# EAGLE schematic Juice Rescue v2 - hw1.0.2 (EAGLE 9.6.2)
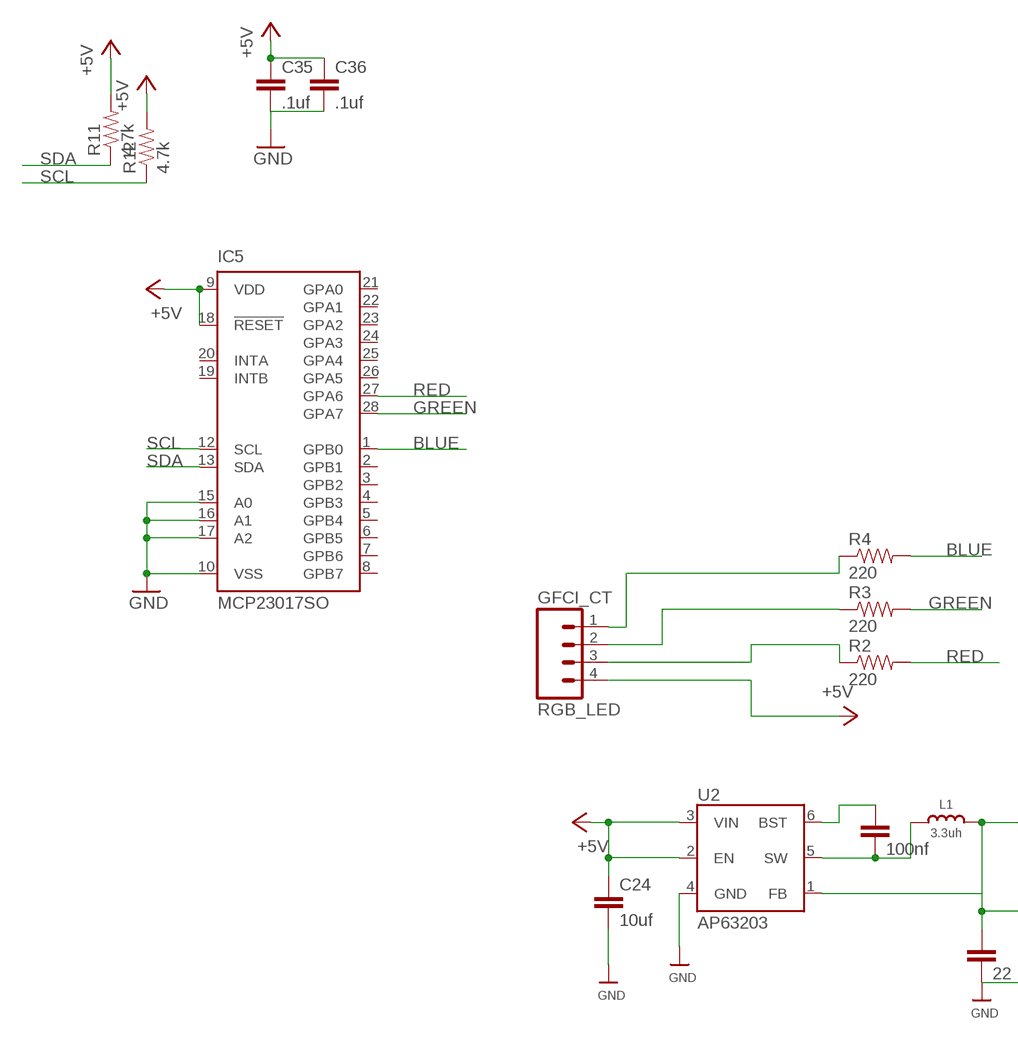
[diagram p0: schematic, sheet 1, part 1 of 2]
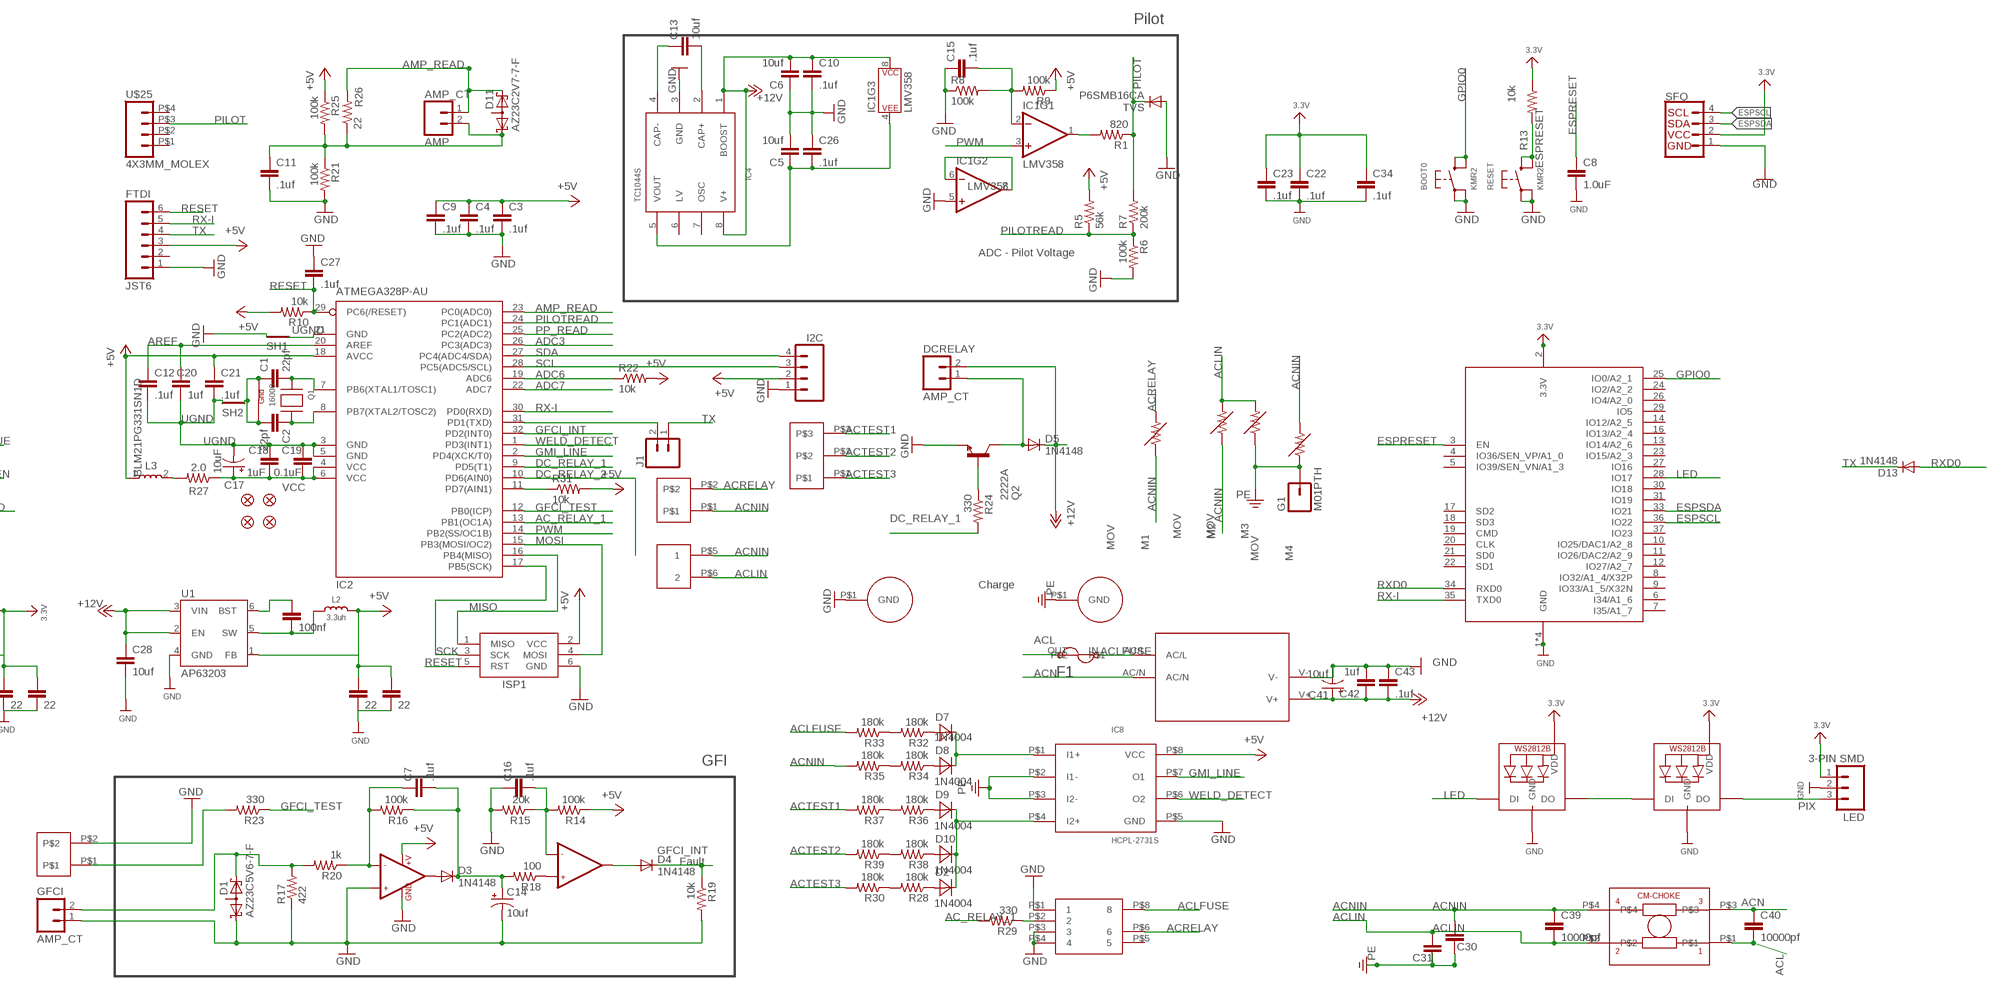
[diagram p1: schematic, sheet 1, part 2 of 2]

## Parts
AC  2POS3.96MM  [2POS3.66MM]
AC_TEST  AMPAC3P  [ACAMP3P]
AMP  AMP_CT  MOLEX_2  [MOLEX_2]
BOOT0  KMR2  SWITCH_TACT_SMT4.6X2.8  [BTN_KMR2_4.6X2.8]
C1  22pf  CAP0805  [0805]
C2  22pf  CAP0805  [0805]
C3  .1uf  CAP0805  [0805]
C4  .1uf  CAP0805  [0805]
C5  10uf  CAP0805  [0805]
C6  10uf  CAP0805  [0805]
C7  .1uf  CAP0805  [0805]
C8  1.0uF  1.0UF-0805-25V-(+80/-20%)  [0805]
C9  .1uf  CAP0805  [0805]
C10  .1uf  CAP0805  [0805]
C11  .1uf  CAP0805  [0805]
C12  .1uf  CAP0805  [0805]
C13  10uf  CAP0805  [0805]
C14  10uf  CAP_POL1206  [EIA3216]
C15  .1uf  CAP0805  [0805]
C16  .1uf  CAP0805  [0805]
C17  10uF  10UF-POLAR-0603-6.3V-20%(TANT)  [0603-POLAR]
C18  1uF  CAP0805  [0805]
C19  0.1uF  CAP0805  [0805]
C20  1uf  CAP0805  [0805]
C21  .1uf  CAP0805  [0805]
C22  .1uf  1.0UF-0805-25V-(+80/-20%)  [0805]
C23  .1uf  1.0UF-0805-25V-(+80/-20%)  [0805]
C24  10uf  1.0UF-0805-25V-(+80/-20%)  [0805]
C25  22  1.0UF-0805-25V-(+80/-20%)  [0805]
C26  .1uf  CAP0805  [0805]
C27  .1uf  CAP0805  [0805]
C28  10uf  1.0UF-0805-25V-(+80/-20%)  [0805]
C29  22  1.0UF-0805-25V-(+80/-20%)  [0805]
C30  100nf  1.0UF-0805-25V-(+80/-20%)  [0805]
C31  22  1.0UF-0805-25V-(+80/-20%)  [0805]
C32  100nf  1.0UF-0805-25V-(+80/-20%)  [0805]
C33  22  1.0UF-0805-25V-(+80/-20%)  [0805]
C34  .1uf  1.0UF-0805-25V-(+80/-20%)  [0805]
C35  .1uf  CAP0805  [0805]
C36  .1uf  CAP0805  [0805]
C37  1000pf  DK1  [DK1E3EA]
C39  10000pf  C7.5/4  [C7.5B4]
C40  10000pf  C7.5/4  [C7.5B4]
C41  10uf  CAP_POL1206  [EIA3216]
C42  1uf  CAP0805  [0805]
C43  .1uf  CAP0805  [0805]
CMC  RN214-0.3-02-47M  [RN214-0.3-02-47M]
D1  AZ23C5V6-7-F  BAS40-06  [SOT23]
D2  1N4004  MBRA340T3  [SMA]
D3  1N4148  DIODE-SOD123  [SOD123]
D4  1N4148  DIODE-SOD123  [SOD123]
D5  1N4148  DIODE-SOD123  [SOD123]
D7  1N4004  MBRA340T3  [SMA]
D8  1N4004  MBRA340T3  [SMA]
D9  1N4004  MBRA340T3  [SMA]
D10  1N4004  MBRA340T3  [SMA]
D11  AZ23C2V7-7-F  BAS40-06  [SOT23]
D13  1N4148  DIODE-SOD123  [SOD123]
DCRELAY  AMP_CT  MOLEX_2  [MOLEX_2]
F1  BEL1.6AFUSE  BEL1AFUSE  [BELFUSE1A]
FID1  FIDUCIAL1X2.5  [FIDUCIAL-1X2.5]
FID2  FIDUCIAL1X2.5  [FIDUCIAL-1X2.5]
FID3  FIDUCIAL1X2.5  [FIDUCIAL-1X2.5]
FID4  FIDUCIAL1X2.5  [FIDUCIAL-1X2.5]
FTDI  JST6  [JST6]
G1  M01PTH  [1X01]
GFCI  AMP_CT  MOLEX_2  [MOLEX_2]
I2C  M04JST-PTH-VERT  [JST-4-PTH-VERT]
IC1  LMV358  LMV358SOIC  [SO08]
IC2  ATMEGA328P-AU  MEGA8-AI  [TQFP32-08]
IC3  LM358  LMV358  [SO08]
IC4  TC1044S  [SO-8]
IC5  MCP23017SO  [SO28W]
IC7  AQH2223  [SIL8]
IC8  HCPL-2731S  [SIL8-2]
ISP1  ISP1  AVRISP-6  [AVRISP]
J1  CONN_02  [1X02]
L1  3.3uh  MICROBUILDER_INDUCTORNR5040  [MICROBUILDER_INDUCTOR_5X5MM_NR5040_NOTHERMALS]
L2  3.3uh  MICROBUILDER_INDUCTORNR5040  [MICROBUILDER_INDUCTOR_5X5MM_NR5040_NOTHERMALS]
L3  BLM21PG331SN1D  [INDC2012X87]
LED  3-PIN SMD  M03JST-SMD  [JST-3-SMD]
LED1  WS2812B3535  [LED3535]
LED2  WS2812B3535  [LED3535]
M1  MOV  [MOV]
M2  MOV  [MOV]
M3  MOV  [MOV]
M4  MOV  [MOV]
PS1  IRM-10-5  [IRM-10-5]
Q1  16000  XTAL-4-3225  [NX3225]
Q2  2222A  BCX70SMD  [SOT23]
R1  820  RESISTOR0805-RES  [0805]
R2  220  RESISTOR0805-RES  [0805]
R3  220  RESISTOR0805-RES  [0805]
R4  220  RESISTOR0805-RES  [0805]
R5  56k  RESISTOR0805-RES  [0805]
R6  100k  RESISTOR0805-RES  [0805]
R7  200k  RESISTOR0805-RES  [0805]
R8  100k  RESISTOR0805-RES  [0805]
R9  100k  RESISTOR0805-RES  [0805]
R10  10k  RESISTOR0805-RES  [0805]
R11  4.7k  RESISTOR0805-RES  [0805]
R12  4.7k  RESISTOR0805-RES  [0805]
R13  10k  RESISTOR0805  [0805]
R14  100k  RESISTOR0805-RES  [0805]
R15  20k  RESISTOR0805-RES  [0805]
R16  100k  RESISTOR0805-RES  [0805]
R17  422  RESISTOR0805-RES  [0805]
R18  100  RESISTOR0805-RES  [0805]
R19  10k  RESISTOR0805-RES  [0805]
R20  1k  RESISTOR0805-RES  [0805]
R21  100k  RESISTOR0805-RES  [0805]
R22  10k  RESISTOR0805-RES  [0805]
R23  330  RESISTOR0805-RES  [0805]
R24  330  RESISTOR0805-RES  [0805]
R25  100k  RESISTOR0805-RES  [0805]
R26  22  R-US_R1206  [R1206]
R27  2.0  RESISTOR0805-RES  [0805]
R28  180k  0.1OHM-1/2W-1%(1210)  [1210]
R29  330  RESISTOR0805-RES  [0805]
R30  180k  0.1OHM-1/2W-1%(1210)  [1210]
R31  10k  RESISTOR0805-RES  [0805]
R32  180k  0.1OHM-1/2W-1%(1210)  [1210]
R33  180k  0.1OHM-1/2W-1%(1210)  [1210]
R34  180k  0.1OHM-1/2W-1%(1210)  [1210]
R35  180k  0.1OHM-1/2W-1%(1210)  [1210]
R36  180k  0.1OHM-1/2W-1%(1210)  [1210]
R37  180k  0.1OHM-1/2W-1%(1210)  [1210]
R38  180k  0.1OHM-1/2W-1%(1210)  [1210]
R39  180k  0.1OHM-1/2W-1%(1210)  [1210]
RESET  KMR2  SWITCH_TACT_SMT4.6X2.8  [BTN_KMR2_4.6X2.8]
RF1  1000pf  DK1  [DK1E3EA]
RGB_LED  GFCI_CT  GFCI_4  [GFCI_4]
SFQ  QWIIC_CONNECTORJS-1MM  [JST04_1MM_RA]
SH1  SHORT-HT5  [SHORT_TOP-50]
SH2  SHORT-HT5  [SHORT_TOP-50]
TEST_COIL  2X4MM  [2X4MM]
TVS  P6SMB16CA  DIODE-SMB  [SMB]
U1  AP63203  [SOT23-6]
U2  AP63203  [SOT23-6]
U$3  HOLE  [HOLE]
U$8  AMPAC  [AMPAC]
U$9  HOLE  [HOLE]
U$25  4X3MM_MOLEX  [4X3MM_MOLEX]
X2  ESP32-WROOM-32  ESP32_WROOM32_SKINNY  [WROOM32_SKINNY]

## Nets
3.3V: C22.1 C23.1 C25.1 C31.1 C34.1 L1.P$2 LED1.2(VDD) LED2.2(VDD) LED.1 R13.1 SFQ.2 U2.1(FB) X2.2(3.3V)
+5V: C3.1 C4.1 C9.1 C21.1 C24.1 C29.1 C33.1 C35.1 C36.1 FTDI.3 I2C.2 IC2.18(AVCC) IC3.8(+V) IC5.9(VDD) IC5.18(!RESET) IC8.P$8(VCC) ISP1.2(VCC) L2.P$2 L3.1 R5.2 R9.1 R10.2 R11.2 R12.2 R14.1 R22.2 R25.1 R31.2 RGB_LED.4 U1.1(FB) U2.2(EN) U2.3(VIN)
+12V: C6.2 C10.1 C28.1 C41.A(+) C42.1 C43.2 D5.C DCRELAY.2 IC1.8(P$V+) IC4.1(BOOST) IC4.8(V+) PS1.V+ U1.2(EN) U1.3(VIN)
-12V1: C5.1 C26.2 IC1.4(P$V-) IC4.5(VOUT)
AC_RELAY_1: IC2.13(PB1(OC1A)) R29.2
ACL: C40.2 CMC.P$1 F1.OUT
ACLFUSE: F1.IN IC7.P$8 PS1.AC/L R33.2
ACLIN: AC.P$6 C39.2 CMC.P$2 M2.P$2 M3.P$2 RF1.P$2
ACN: C40.1 CMC.P$3 PS1.AC/N
ACNIN: AC.P$5 C37.P$2 C39.1 CMC.P$4 M1.P$1 M2.P$1 M4.P$2 R35.2 U$8.P$1
ACRELAY: IC7.P$6 M1.P$2 U$8.P$2
ACTEST1: AC_TEST.P$3 R37.2
ACTEST2: AC_TEST.P$2 R39.2
ACTEST3: AC_TEST.P$1 R30.2
ADC3: IC2.26(PC3(ADC3))
ADC6: IC2.19(ADC6) R22.1
ADC7: IC2.22(ADC7)
AMP_READ: AMP.1 D11.2(K2) IC2.23(PC0(ADC0)) R26.2
AREF: C12.1 C20.1 IC2.20(AREF)
BLUE: IC5.1(GPB0) R4.2
DAMP: L3.2 R27.2
DC_RELAY_1: IC2.9(PD5(T1)) R24.2
DC_RELAY_1_O: D5.A DCRELAY.1 Q2.3(C)
DC_RELAY_1_T: Q2.1(B) R24.1
DC_RELAY_2: IC2.10(PD6(AIN0))
ESPRESET: C8.1 R13.2 RESET.B'(S1) RESET.B(S) X2.3(EN)
ESPSCL: SFQ.4 X2.36(IO22)
ESPSDA: SFQ.3 X2.33(IO21)
GFCI_INT: D4.C IC2.32(PD2(INT0)) R19.1
GFCI_TEST: IC2.12(PB0(ICP)) R23.1
GFI_TEST_O: R23.2 TEST_COIL.P$1
GMI_LINE: IC2.2(PD4(XCK/T0)) IC8.P$7(O1)
GND: BOOT0.A'(P1) BOOT0.A(P) C3.2 C4.2 C5.2 C6.1 C8.2 C9.2 C10.2 C11.2 C14.C(-) C15.1 C16.1 C22.2 C23.2 C24.2 C25.2 C26.1 C27.1 C28.2 C29.2 C31.2 C33.2 C34.2 C35.2 C36.2 C41.C(-) C42.2 C43.1 D1.1(K1) FTDI.1 GFCI.1 I2C.1 IC1.5(+IN) IC3.3(+IN1) IC3.4(GND) IC4.3(GND) IC5.10(VSS) IC5.15(A0) IC5.16(A1) IC5.17(A2) IC7.P$1 IC7.P$3 IC7.P$4 IC8.P$5(GND) ISP1.6(GND) LED1.4(GND) LED2.4(GND) LED.2 PS1.V- Q2.2(E) R6.2 R8.1 R15.2 R17.1 R19.2 R21.2 RESET.A'(P1) RESET.A(P) SFQ.1 SH1.2 TEST_COIL.P$2 TVS.A U1.4(GND) U2.4(GND) U$9.P$1(GND) X2.1(GND) X2.15(GND) X2.38(GND) X2.P$1(GND)
GPIO0: BOOT0.B'(S1) BOOT0.B(S) X2.25(IO0/A2_1)
GREEN: IC5.28(GPA7) R3.2
LED: LED1.1(DI) X2.28(IO17)
MISO: IC2.16(PB4(MISO)) ISP1.1(MISO)
MOSI: IC2.15(PB3(MOSI/OC2)) ISP1.4(MOSI)
N$1: D2.C D9.C D10.C IC8.P$4(I2+)
N$2: D7.C D8.C IC8.P$1(I1+)
N$4: C1.2 IC2.7(PB6(XTAL1/TOSC1)) Q1.2(X1)
N$5: C2.1 IC2.8(PB7(XTAL2/TOSC2)) Q1.4(X2)
N$6: D7.A R32.1
N$7: AMP.2 C11.1 D11.1(K1) R21.1 R25.2 R26.1
N$8: C7.1 IC3.2(-IN1) R16.2 R20.1
N$9: D8.A R34.1
N$10: C15.2 IC1.2(-IN) R8.2 R9.2
N$11: IC1.1(OUT) R1.2
N$12: IC2.11(PD7(AIN1)) R31.1
N$13: R32.2 R33.1
N$14: IC1.6(-IN) IC1.7(OUT)
N$15: C32.1 U1.6(BST)
N$16: C32.2 L2.P$1 U1.5(SW)
N$17: R34.2 R35.1
N$18: IC7.P$2 R29.1
N$19: C13.2 IC4.2(CAP+)
N$21: D3.A IC3.1(OUT1)
N$22: R36.2 R37.1
N$23: C7.2 C14.A(+) D3.C R16.1 R18.2
N$24: C16.2 IC3.6(-IN2) R14.2 R15.1
N$25: D4.A IC3.7(OUT2)
N$26: IC3.5(+IN2) R18.1
N$27: C13.1 IC4.4(CAP-)
N$28: R38.2 R39.1
N$29: D9.A R36.1
N$30: D10.A R38.1
N$31: R3.1 RGB_LED.2
N$32: R2.1 RGB_LED.3
N$33: LED1.3(DO) LED2.1(DI)
N$34: C30.1 U2.6(BST)
N$35: C30.2 L1.P$1 U2.5(SW)
N$36: R4.1 RGB_LED.1
N$37: IC2.31(PD1(TXD)) J1.2
N$38: D2.A R28.1
N$39: R28.2 R30.1
N$40: D1.2(K2) GFCI.2 R17.2 R20.2
PE: C37.P$1 G1.1 IC8.P$2(I1-) IC8.P$3(I2-) M3.P$1 M4.P$1 RF1.P$1 U$3.P$1(GND)
PILOT: R1.1 R7.2 TVS.C U$25.P$3
PILOTREAD: IC2.24(PC1(ADC1)) R5.1 R6.1 R7.1
PIX: LED2.3(DO) LED.3
PP_READ: IC2.25(PC2(ADC2))
PWM: IC1.3(+IN) IC2.14(PB2(SS/OC1B))
RED: IC5.27(GPA6) R2.2
RESET: C27.2 FTDI.6 IC2.29(PC6(/RESET)) ISP1.5(RST) R10.1
RX-I: FTDI.5 IC2.30(PD0(RXD)) X2.35(TXD0)
RXD0: D13.A X2.34(RXD0)
SCK: IC2.17(PB5(SCK)) ISP1.3(SCK)
SCL: I2C.3 IC2.28(PC5(ADC5/SCL)) IC5.12(SCL) R12.1
SDA: I2C.4 IC2.27(PC4(ADC4/SDA)) IC5.13(SDA) R11.1
TX: D13.C FTDI.4 J1.1
UGND: C12.2 C17.- C18.1 C19.1 C20.2 C21.2 IC2.3(GND) IC2.5(GND) IC2.21(GND) SH1.1 SH2.2
VCC: C17.+ C18.2 C19.2 IC2.4(VCC) IC2.6(VCC) R27.1
WELD_DETECT: IC2.1(PD3(INT1)) IC8.P$6(O2)
XGND: C1.1 C2.2 Q1.1(G1) Q1.3(G2) SH2.1
Unconnected: D1.3(AA) D11.3(AA) FTDI.2 IC4.6(LV) IC4.7(OSC) IC5.2(GPB1) IC5.3(GPB2) IC5.4(GPB3) IC5.5(GPB4) IC5.6(GPB5) IC5.7(GPB6) IC5.8(GPB7) IC5.19(INTB) IC5.20(INTA) IC5.21(GPA0) IC5.22(GPA1) IC5.23(GPA2) IC5.24(GPA3) IC5.25(GPA4) IC5.26(GPA5) IC7.P$5 U$25.P$1 U$25.P$2 U$25.P$4 X2.4(IO36/SEN_VP/A1_0) X2.5(IO39/SEN_VN/A1_3) X2.6(I34/A1_6) X2.7(I35/A1_7) X2.8(IO32/A1_4/X32P) X2.9(IO33/A1_5/X32N) X2.10(IO25/DAC1/A2_8) X2.11(IO26/DAC2/A2_9) X2.12(IO27/A2_7) X2.13(IO14/A2_6) X2.14(IO12/A2_5) X2.16(IO13/A2_4) X2.17(SD2) X2.18(SD3) X2.19(CMD) X2.20(CLK) X2.21(SD0) X2.22(SD1) X2.23(IO15/A2_3) X2.24(IO2/A2_2) X2.26(IO4/A2_0) X2.27(IO16) X2.29(IO5) X2.30(IO18) X2.31(IO19) X2.37(IO23)

## Notes on the sheet
- Pilot
- ADC - Pilot Voltage
- Charge
- GFI
- Fault

## Library data of the parts
AC = OpenEVSE:2POS3.96MM
AC_TEST = OpenEVSE:AMPAC3P
AMP DCRELAY GFCI = OpenEVSE:MOLEX_2
BOOT0 RESET = microbuilder:SWITCH_TACT_SMT: SMT Tact Switches 6x6mm - Digikey: P12940SCT-ND KMR2 (4.6x2.8mm) - Digikey: 401-1426-1-ND EVQ-PQHB55 - Light Touch, 160GF (4.5x4.5mm) - Digikey: P8090SCT-ND KMT0 - KMT021 NGJ LHS (etc.) IP68/Waterproof - Digikey: CKN10289CT-ND
C1-C7 C9-C13 C15 C16 C18-C21 C26 C27 C35 C36 C42 C43 = SparkFun:CAP: Capacitor Standard 0603 ceramic capacitor, and 0.1" leaded capacitor.
C8 = SparkFun-Capacitors:1.0UF: 1µF ceramic capacitors A capacitor is a passive two-terminal electrical component used to store electrical energy temporarily in an electric field.; PROD_ID: CAP-11625
C14 C41 = SparkFun:CAP_POL: Capacitor Polarized These are standard SMD and PTH capacitors. Normally 10uF, 47uF, and 100uF in electrolytic and tantalum varieties. Always verify the external diameter of the through hole cap, it varies with capacity, voltage, and manufacturer. The EIA devices should be standard.
C17 = SparkFun-Capacitors:10UF-POLAR: 10.0µF polarized capacitors A capacitor is a passive two-terminal electrical component used to store electrical energy temporarily in an electric field.; PROD_ID: CAP-13210
C22-C25 C28-C34 = SparkFun-Capacitors:1.0UF: 1µF ceramic capacitors A capacitor is a passive two-terminal electrical component used to store electrical energy temporarily in an electric field.; PROD_ID: CAP-11625; VALUE: 1.0uF
C37 RF1 = OpenEVSE:DK1
C39 C40 = capacitor-wima:C: CAPACITOR naming: grid - package width
CMC = Schaffner-CM-Choke:RN214-0.3-02-47M
D1 D11 = diode:BAS40-06: Silicon Schottky Diodes General-purpose diode for high-speed switching
D2 D7-D10 = diode:MBRA340T3: Surface Mount Schottky Power Rectifier Source: http://www.onsemi.com/pub_link/Collateral/MBRA340T3-D.PDF
D3-D5 D13 TVS = diode:DIODE-: DIODE
F1 = Qxd:BEL1AFUSE
FID1-FID4 = SparkFun-Retired:FIDUCIAL: Fiducial Alignment Points Various fiducial points for machine vision alignment.
FTDI = OpenEVSE:JST6
G1 = SparkFun:M01: Header 1 Standard 1-pin 0.1" header. Use with straight break away headers (SKU : PRT-00116), right angle break away headers (PRT-00553), swiss pins (PRT-00743), machine pins (PRT-00117), and female headers (PRT-00115).
I2C = SparkFun-Connectors:M04: Header 4 Standard 4-pin 0.1" header. Use with straight break away headers (SKU : PRT-00116), right angle break away headers (PRT-00553), swiss pins (PRT-00743), machine pins (PRT-00117), and female headers (PRT-00115). Molex polarized connector foot print use with SKU : PRT-08231 with associated crimp pins and housings. 1MM SMD Version SKU: PRT-10208
IC1 = SparkFun-IC-Amplifiers:LMV358: IC LMV358 DUAL OP AMP Jellybean rail-to-rail output op-amp SparkFun Products SparkFun PicoBoard <https://www.sparkfun.com/products/11888> (WIG-11888) SparkFun Vernier Interface Shield <https://www.sparkfun.com/products/12858> (DEV-12858) SparkFun Blynk Board - ESP8266 <https://www.sparkfun.com/products/13794> (WRL-13794) SparkFun Digital Sandbox <https://www.sparkfun.com/products/12651> (DEV-12651 RoHS); PROD_ID: IC-09657
IC2 = atmel:MEGA8: MICROCONTROLLER 8 Kbytes FLASH, 1 kbytes SRAM, 512 bytes EEPROM, USART, 6-channel 10 bit ADC, 2-channel 8 bit ADC Pin compatible with Atmega48, ATMega88, ATMega168 Source: avr.lbr; MPN: ATMEGA8-16AU; OC_FARNELL: 9171371; OC_NEWARK: 73M8863
IC3 = SparkFun:LMV358
IC4 = OpenEVSE:TC1044S
IC5 = adafruit:MCP23017: http://ww1.microchip.com/downloads/en/DeviceDoc/21952a.pdf Source: http://ww1.microchip.com/downloads/en/DeviceDoc/21952a.pdf
IC7 = OpenEVSE:AQH2223
IC8 = OpenEVSE:HCPL-2731S
ISP1 = adafruit:AVRISP: AVR ISP HEADER Standard 6 pin header for AVR programming
J1 = SparkFun-Connectors:CONN_02: Multi connection point. Often used as Generic Header-pin footprint for 0.1 inch spaced/style header connections On any of the 0.1 inch spaced packages, you can populate with these: Break Away Headers - Straight <https://www.sparkfun.com/products/116> (PRT-00116) Break Away Male Headers - Right Angle <https://www.sparkfun.com/products/553> (PRT-00553) Female Headers <https://www.sparkfun.com/products/115> (PRT-00115) Break Away Headers - Machine Pin <https://www.sparkfun.com/products/117> (PRT-00117) Break Away Female Headers - Swiss Machine Pin <https://www.sparkfun.com/products/743> (PRT-00743) For SCREWTERMINALS and SPRING TERMINALS visit here: Screw Terimnals on SparkFun.com <https://www.sparkfun.com/search/results?term=Screw+Terminals> (5mm/3.5mm/2.54mm spacing) This device is also useful as a general connection point to wire up your design to another part of your project. Our various solder wires solder well into these plated through hole pads. Hook-Up Wire - Assortment (Stranded, 22 AWG) <https://www.sparkfun.com/products/11375> (PRT-11375) Hook-Up Wire - Assortment (Solid Core, 22 AWG) <https://www.sparkfun.com/products/11367> (PRT-11367) View the entire wire category on our website here <https://www.sparkfun.com/categories/141> Special notes: Molex polarized connector foot print use with: PRT-08233 with associated crimp pins and housings. 2.54_SCREWTERM for use with PRT-10571. 3.5mm Screw Terminal footprints for PRT-08084 5mm Screw Terminal footprints for use with PRT-08432
L1 L2 = ESP32_v1_SMPS:MICROBUILDER_INDUCTOR: Inductors 0603: 10nH Ceramic Inductor - microwire antenna/RF (Digikey: 712-1434-2-ND) 0805: 560nH Ceramic Inductor - RF (Digikey: 553-1047-1-ND) 270nH Ceramic Inductor - Q = 40@250MHz, +-5%, 1 Ohm DC Resistance (Digikey: 535-10506-2-ND) 1007 (2518 Metric) SMT: 10µH 10% 250mOhm 820mA 1007 Inductor (Digikey: 587-2189-1-ND) 22µH 10% 500mOhm 580mA 1007 Inductor (Digikey: 587-2190-1-ND) 47µH 10% 950mOhm 420mA 1007 Inductor (Digikey: 587-2191-1-ND) 47µH 5% 100mOhm 1A 1008 Inductor (Digikey: 732-1816-1-ND) 5.0x5.0mm (Taiyo Yuden NR5040 Series) 6.8µH 20% 2.3A 64mOhm Inductor (Digikey: 587-2374-2-ND) 5.0x5.0mm (TDK VLC5045 Series) 4.7µH 20% 3.3A 34mOhm Inductor (Digikey: 445-6526-1-ND) 6.8µH 20% 2.7A 46mOhm Inductor (Digikey: 445-6527-1-ND) 6.0x6.0mm (TDK VLC6045 Series) 4.7µH 20% 3.8A 27mOhm Inductor (Digikey: 445-6538-2-ND) 6.8µH 20% 3A 41mOhm Inductor (Digikey: 445-6540-1-ND) 6.2µH 30% 2.2A 45mOhm Inductor (Digikey: SRR5028-6R2YCT-ND) - Not TDK VLC6045 but footprint should match 6.0x6.0mm (TDK SLF6045 Series) 6.8uH 30% 2A 33mOhm Inductor (Digikey: 445-4572-1-ND, Mouser: 810-SLF645T6R8N2R0PF) 6.0x6.0mm (Sumida CDRH5D28 Series) 6.2uH 30% 1.8A 45mOhm Inductor (Digikey: 308-1542-1-ND) Taiyo Yuden NR3015T2R2M - 2.2uH 20% 1.5A (Digikey: 587-1648-2-ND, Mouser: 963-NR3015T2R2M) - Used with TI TPS62172 CoilCraft RFID Transponder Coil - MA5532-AE (For use with AS3935 Lightning Sensor)
L3 = BLM21PG331SN1D:BLM21PG331SN1D: Ferrite Beads Multi-Layer 330Ohm 25% 100MHz 1.5A 70mOhm DCR 0805 Paper T/R; DESCRIPTION: Ferrite Beads Multi-Layer 330Ohm 25% 100MHz 1.5A 70mOhm DCR 0805 Paper T/R; MF: Murata; MP: BLM21PG331SN1D; PACKAGE: 0805 Murata
LED = SparkFun-Connectors:M03: Header 3 Standard 3-pin 0.1" header. Use with straight break away headers (SKU : PRT-00116), right angle break away headers (PRT-00553), swiss pins (PRT-00743), machine pins (PRT-00117), and female headers (PRT-00115). Molex polarized connector foot print use with SKU : PRT-08232 with associated crimp pins and housings.; PROD_ID: CONN-12591
LED1 LED2 = adafruit:WS2812B
M1-M4 = OpenEVSE:MOV
PS1 = OpenEVSE:IRM-10-5
Q1 = adafruit:XTAL-4: Classic 4-pin 3.2 x 2.5mm crystal
Q2 = transistor-npn:BCX70*: NPN Transistor
R1-R12 R14-R25 R27 R29 R31 = SparkFun:RESISTOR: Resistor Basic schematic elements and footprints for 0603, 1206, and PTH resistors.
R13 = SparkFun-Resistors:RESISTOR: Generic Resistor Package
R26 = rcl:R-US_: RESISTOR, American symbol
R28 R30 R32-R39 = SparkFun-Resistors:0.1OHM-1/2W-1%(1210); PROD_ID: RES-12374
RGB_LED = OpenEVSE:GFCI_4
SFQ = SparkFun-Connectors:QWIIC_CONNECTOR: SparkFun I2C Standard Qwiic Connector An SMD 1mm pitch JST connector makes it easy and quick (get it? Qwiic?) to connect I2C devices to each other. The Qwiic system <http://www.sparkfun.com/qwiic> enables fast and solderless connection between popular platforms and various sensors and actuators. We carry 200mm <https://www.sparkfun.com/products/14204>, 100mm <https://www.sparkfun.com/products/14205>, 50mm <https://www.sparkfun.com/products/14206>, and breadboard friendly <https://www.sparkfun.com/products/14207> Qwiic cables. We also offer 10 pcs strips <https://www.sparkfun.com/products/14323> the SMD connectors.; PROD_ID: CONN-13694
SH1 SH2 = shorts-old:SHORT-H: Short between two nets; BOM: no
TEST_COIL = OpenEVSE:2X4MM
U1 U2 = SparkFun-IC-Power:AP63203: Diodes Inc. AP63203 3.8V-32V input 3.3V Buck The AP63200/AP63201/AP63203/AP63205 is a 2A, synchronous buck converter with a wide input voltage range of 3.8V to 32V and fully integrates a 125mΩ high-side power MOSFET and a 68mΩ lowside power MOSFET to provide high-efficiency step-down DC/DC conversion; PROD_ID: VREG-15244
U$3 U$9 = OpenEVSE:HOLE
U$8 = OpenEVSE:AMPAC
U$25 = OpenEVSE:4X3MM_MOLEX
X2 = microbuilder:ESP32_WROOM32